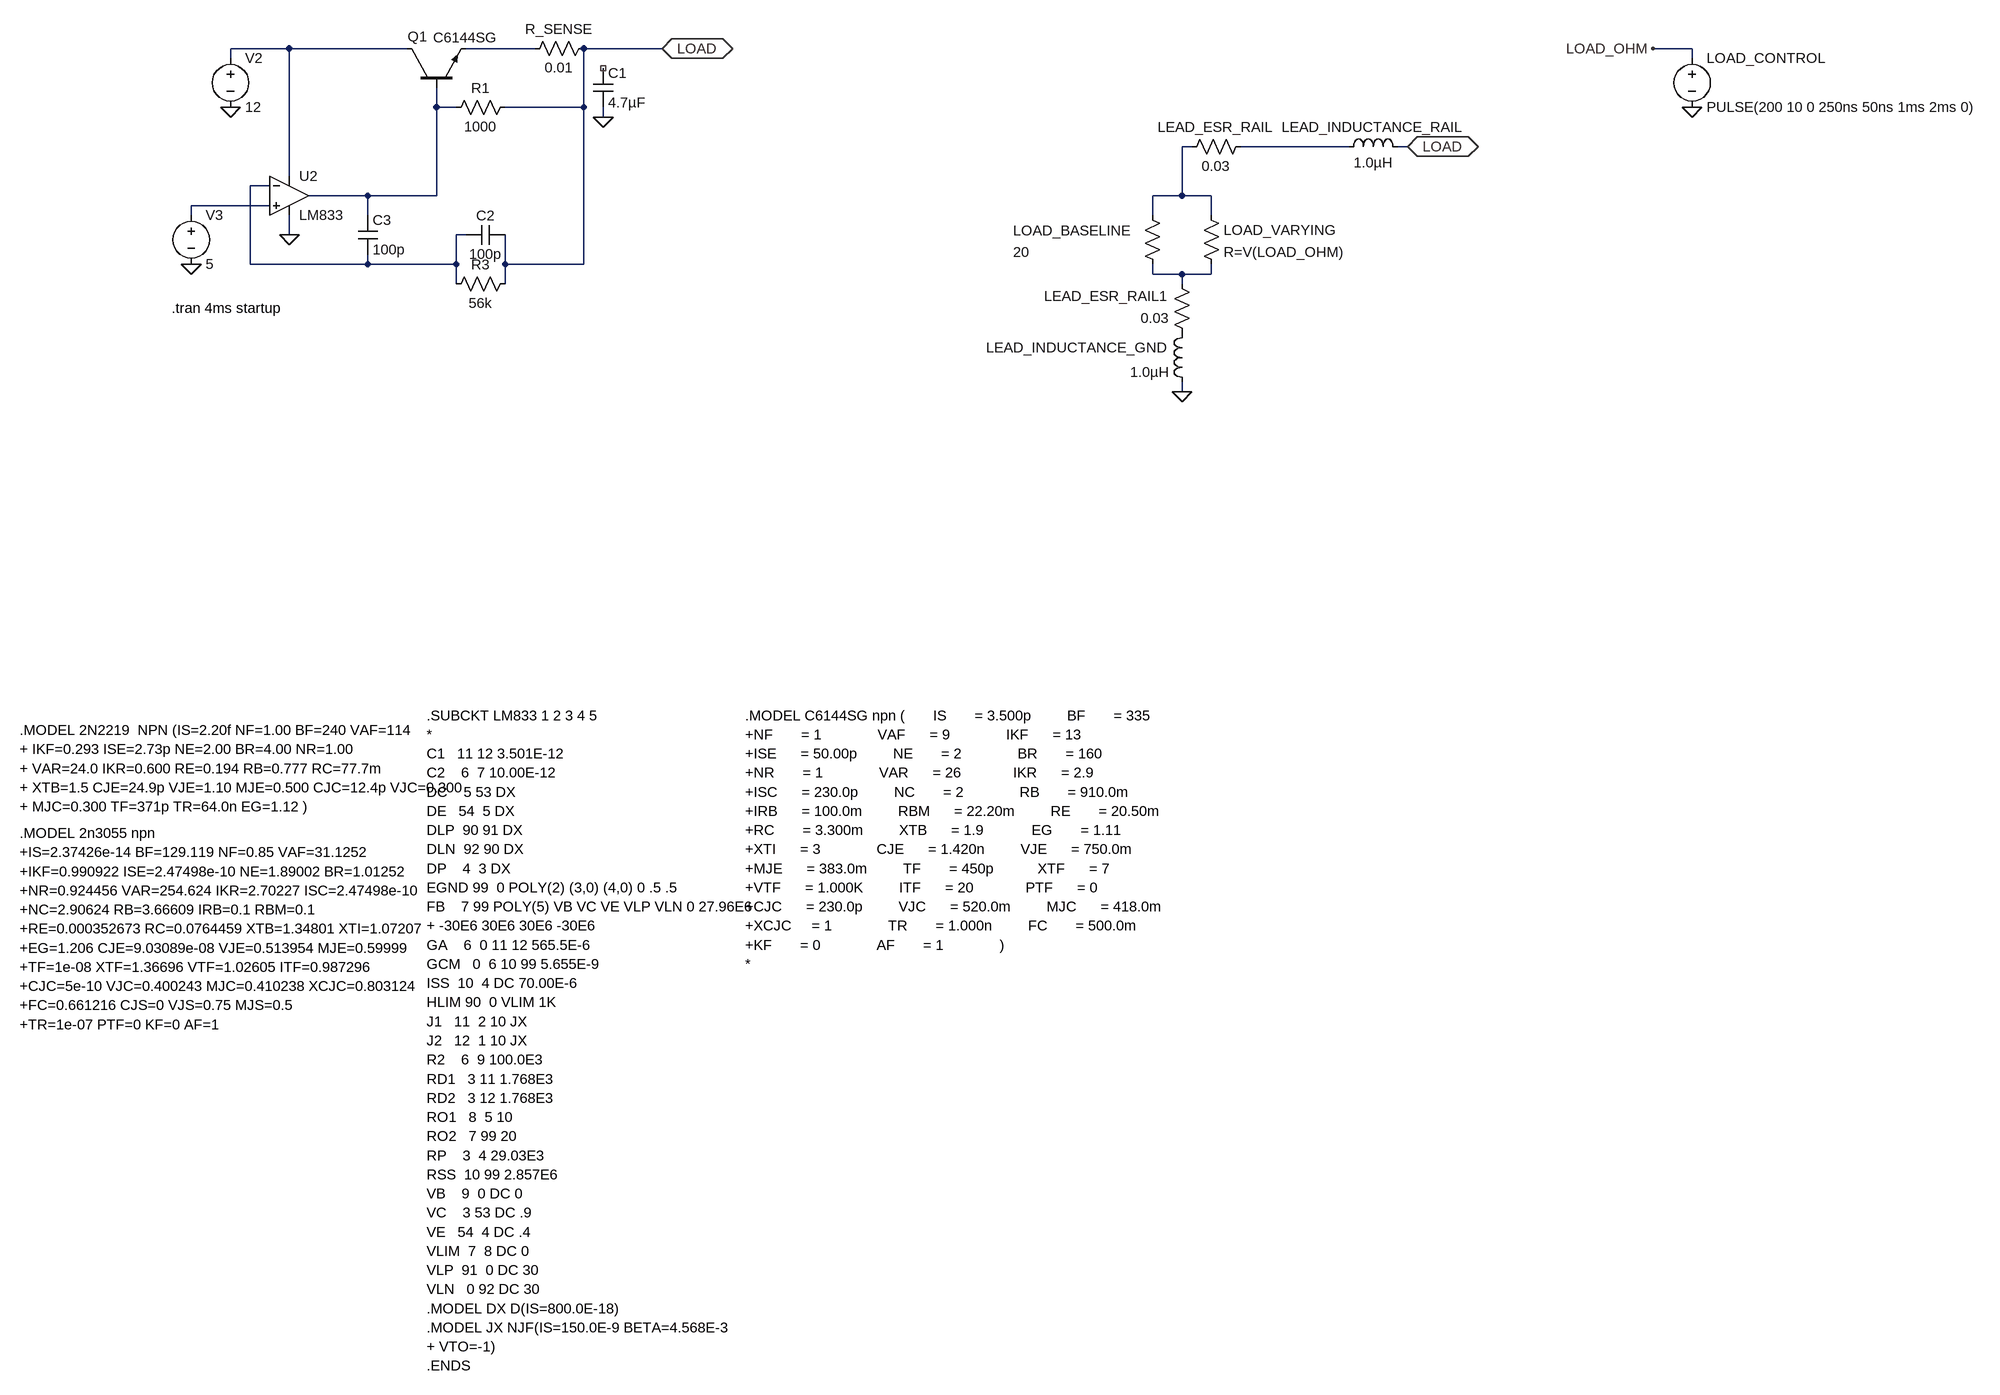
[diagram p0: schematic npn-pass-element-1.asc]
npn-pass-element-1.asc, the LTspice schematic file:
Version 4
SHEET 1 2764 2152
WIRE -128 96 -224 96
WIRE 64 96 -128 96
WIRE 272 96 160 96
WIRE 480 96 352 96
WIRE 2160 96 2096 96
WIRE -224 112 -224 96
WIRE 2160 112 2160 96
WIRE 112 192 112 160
WIRE 144 192 112 192
WIRE 352 192 352 96
WIRE 352 192 224 192
WIRE 384 208 384 192
WIRE 1344 256 1328 256
WIRE 1600 256 1424 256
WIRE 1696 256 1680 256
WIRE -128 304 -128 96
WIRE -160 320 -192 320
WIRE 0 336 -96 336
WIRE 112 336 112 192
WIRE 112 336 0 336
WIRE 1328 336 1328 256
WIRE 1328 336 1280 336
WIRE 1376 336 1328 336
WIRE -160 352 -288 352
WIRE -288 368 -288 352
WIRE 0 368 0 336
WIRE 1280 368 1280 336
WIRE 1376 368 1376 336
WIRE -128 400 -128 368
WIRE 160 400 144 400
WIRE -192 448 -192 320
WIRE 0 448 0 432
WIRE 0 448 -192 448
WIRE 144 448 144 400
WIRE 144 448 0 448
WIRE 224 448 224 400
WIRE 352 448 352 192
WIRE 352 448 224 448
WIRE 1280 464 1280 448
WIRE 1328 464 1280 464
WIRE 1376 464 1376 448
WIRE 1376 464 1328 464
WIRE 144 480 144 448
WIRE 224 480 224 448
WIRE 1328 480 1328 464
WIRE 1328 656 1328 640
FLAG -224 192 0
FLAG -128 400 0
FLAG -288 448 0
FLAG 2160 192 0
FLAG 2096 96 LOAD_OHM
FLAG 384 208 0
FLAG 480 96 LOAD
IOPIN 480 96 BiDir
FLAG 1696 256 LOAD
IOPIN 1696 256 BiDir
FLAG 1328 656 0
SYMBOL npn 64 160 R270
WINDOW 0 83 1 VRight 2
WINDOW 3 82 43 VRight 2
SYMATTR InstName Q1
SYMATTR Value C6144SG
SYMBOL voltage -224 96 R0
WINDOW 123 0 0 Left 2
WINDOW 39 0 0 Left 2
SYMATTR InstName V2
SYMATTR Value 12
SYMBOL voltage -288 352 R0
WINDOW 123 0 0 Left 2
WINDOW 39 0 0 Left 2
SYMATTR InstName V3
SYMATTR Value 5
SYMBOL res 240 176 R90
WINDOW 0 0 56 VBottom 2
WINDOW 3 32 56 VTop 2
SYMATTR InstName R1
SYMATTR Value 1000
SYMBOL voltage 2160 96 R0
WINDOW 123 0 0 Left 2
WINDOW 39 0 0 Left 2
SYMATTR InstName LOAD_CONTROL
SYMATTR Value PULSE(200 10 0 250ns 50ns 1ms 2ms 0)
SYMBOL res 1360 352 R0
SYMATTR InstName LOAD_VARYING
SYMATTR Value R=V(LOAD_OHM)
SYMBOL cap 368 128 R0
SYMATTR InstName C1
SYMATTR Value 4.7µF
SYMATTR SpiceLine Rser=0.1
SYMBOL res 240 464 R90
WINDOW 0 0 56 VBottom 2
WINDOW 3 32 56 VTop 2
SYMATTR InstName R3
SYMATTR Value 56k
SYMBOL cap 224 384 R90
WINDOW 0 0 32 VBottom 2
WINDOW 3 32 32 VTop 2
SYMATTR InstName C2
SYMATTR Value 100p
SYMBOL cap -16 368 R0
SYMATTR InstName C3
SYMATTR Value 100p
SYMBOL Opamps\\opamp2 -128 272 R0
SYMATTR InstName U2
SYMATTR Value LM833
SYMBOL res 1264 352 R0
WINDOW 0 -211 41 Left 2
WINDOW 3 -211 76 Left 2
SYMATTR InstName LOAD_BASELINE
SYMATTR Value 20
SYMBOL ind 1696 272 M270
WINDOW 0 32 56 VTop 2
WINDOW 3 5 56 VBottom 2
SYMATTR InstName LEAD_INDUCTANCE_RAIL
SYMATTR Value 1.0µH
SYMBOL res 256 112 R270
WINDOW 0 32 56 VTop 2
WINDOW 3 0 56 VBottom 2
SYMATTR InstName R_SENSE
SYMATTR Value 0.01
SYMBOL ind 1344 544 M0
SYMATTR InstName LEAD_INDUCTANCE_GND
SYMATTR Value 1.0µH
SYMBOL res 1440 240 R90
WINDOW 0 0 56 VBottom 2
WINDOW 3 32 56 VTop 2
SYMATTR InstName LEAD_ESR_RAIL
SYMATTR Value 0.03
SYMBOL res 1344 576 R180
WINDOW 0 36 76 Left 2
WINDOW 3 36 40 Left 2
SYMATTR InstName LEAD_ESR_RAIL1
SYMATTR Value 0.03
TEXT -320 520 Left 2 !.tran 4ms startup
TEXT -568 1208 Left 2 !.MODEL 2N2219  NPN (IS=2.20f NF=1.00 BF=240 VAF=114\n+ IKF=0.293 ISE=2.73p NE=2.00 BR=4.00 NR=1.00\n+ VAR=24.0 IKR=0.600 RE=0.194 RB=0.777 RC=77.7m\n+ XTB=1.5 CJE=24.9p VJE=1.10 MJE=0.500 CJC=12.4p VJC=0.300\n+ MJC=0.300 TF=371p TR=64.0n EG=1.12 )
TEXT -568 1376 Left 2 !.MODEL 2n3055 npn\n+IS=2.37426e-14 BF=129.119 NF=0.85 VAF=31.1252\n+IKF=0.990922 ISE=2.47498e-10 NE=1.89002 BR=1.01252\n+NR=0.924456 VAR=254.624 IKR=2.70227 ISC=2.47498e-10\n+NC=2.90624 RB=3.66609 IRB=0.1 RBM=0.1\n+RE=0.000352673 RC=0.0764459 XTB=1.34801 XTI=1.07207\n+EG=1.206 CJE=9.03089e-08 VJE=0.513954 MJE=0.59999\n+TF=1e-08 XTF=1.36696 VTF=1.02605 ITF=0.987296\n+CJC=5e-10 VJC=0.400243 MJC=0.410238 XCJC=0.803124\n+FC=0.661216 CJS=0 VJS=0.75 MJS=0.5\n+TR=1e-07 PTF=0 KF=0 AF=1
TEXT 96 1184 Left 2 !.SUBCKT LM833 1 2 3 4 5\n*\nC1   11 12 3.501E-12\nC2    6  7 10.00E-12\nDC    5 53 DX\nDE   54  5 DX\nDLP  90 91 DX\nDLN  92 90 DX\nDP    4  3 DX\nEGND 99  0 POLY(2) (3,0) (4,0) 0 .5 .5\nFB    7 99 POLY(5) VB VC VE VLP VLN 0 27.96E6\n+ -30E6 30E6 30E6 -30E6\nGA    6  0 11 12 565.5E-6\nGCM   0  6 10 99 5.655E-9\nISS  10  4 DC 70.00E-6\nHLIM 90  0 VLIM 1K\nJ1   11  2 10 JX\nJ2   12  1 10 JX\nR2    6  9 100.0E3\nRD1   3 11 1.768E3\nRD2   3 12 1.768E3\nRO1   8  5 10\nRO2   7 99 20\nRP    3  4 29.03E3\nRSS  10 99 2.857E6\nVB    9  0 DC 0\nVC    3 53 DC .9\nVE   54  4 DC .4\nVLIM  7  8 DC 0\nVLP  91  0 DC 30\nVLN   0 92 DC 30\n.MODEL DX D(IS=800.0E-18)\n.MODEL JX NJF(IS=150.0E-9 BETA=4.568E-3\n+ VTO=-1)\n.ENDS
TEXT 616 1184 Left 2 !.MODEL C6144SG npn (       IS       = 3.500p         BF       = 335           \n+NF       = 1              VAF      = 9              IKF      = 13            \n+ISE      = 50.00p         NE       = 2              BR       = 160           \n+NR       = 1              VAR      = 26             IKR      = 2.9           \n+ISC      = 230.0p         NC       = 2              RB       = 910.0m        \n+IRB      = 100.0m         RBM      = 22.20m         RE       = 20.50m        \n+RC       = 3.300m         XTB      = 1.9            EG       = 1.11          \n+XTI      = 3              CJE      = 1.420n         VJE      = 750.0m        \n+MJE      = 383.0m         TF       = 450p           XTF      = 7             \n+VTF      = 1.000K         ITF      = 20             PTF      = 0             \n+CJC      = 230.0p         VJC      = 520.0m         MJC      = 418.0m        \n+XCJC     = 1              TR       = 1.000n         FC       = 500.0m        \n+KF       = 0              AF       = 1              )                        \n*

The netlist it stands for:
* npn-pass-element-1.asc
Q1 N001 N003 N002 0 C6144SG
V2 N001 0 12
V3 N007 0 5
R1 LOAD N003 1000
V§LOAD_CONTROL LOAD_OHM 0 PULSE(200 10 0 250ns 50ns 1ms 2ms 0)
R§LOAD_VARYING N004 N008 R=V(LOAD_OHM)
C1 NC_01 0 4.7µF Rser=0.1
R3 LOAD N006 56k
C2 LOAD N006 100p
C3 N003 N006 100p
XU2 N007 N006 N001 0 N003 LM833  ; pins In+ In- V+ V- OUT
R§LOAD_BASELINE N004 N008 20
LEAD_INDUCTANCE_RAIL LOAD N005 1.0µH
R_SENSE N002 LOAD 0.01
LEAD_INDUCTANCE_GND P001 0 1.0µH
R§LEAD_ESR_RAIL N005 N004 0.03
R§LEAD_ESR_RAIL1 P001 N008 0.03
.model NPN NPN
.model PNP PNP
.lib standard.bjt
.tran 4ms startup
.MODEL 2N2219  NPN (IS=2.20f NF=1.00 BF=240 VAF=114
+ IKF=0.293 ISE=2.73p NE=2.00 BR=4.00 NR=1.00
+ VAR=24.0 IKR=0.600 RE=0.194 RB=0.777 RC=77.7m
+ XTB=1.5 CJE=24.9p VJE=1.10 MJE=0.500 CJC=12.4p VJC=0.300
+ MJC=0.300 TF=371p TR=64.0n EG=1.12 )
.MODEL 2n3055 npn
+IS=2.37426e-14 BF=129.119 NF=0.85 VAF=31.1252
+IKF=0.990922 ISE=2.47498e-10 NE=1.89002 BR=1.01252
+NR=0.924456 VAR=254.624 IKR=2.70227 ISC=2.47498e-10
+NC=2.90624 RB=3.66609 IRB=0.1 RBM=0.1
+RE=0.000352673 RC=0.0764459 XTB=1.34801 XTI=1.07207
+EG=1.206 CJE=9.03089e-08 VJE=0.513954 MJE=0.59999
+TF=1e-08 XTF=1.36696 VTF=1.02605 ITF=0.987296
+CJC=5e-10 VJC=0.400243 MJC=0.410238 XCJC=0.803124
+FC=0.661216 CJS=0 VJS=0.75 MJS=0.5
+TR=1e-07 PTF=0 KF=0 AF=1
.SUBCKT LM833 1 2 3 4 5
*
C1   11 12 3.501E-12
C2    6  7 10.00E-12
DC    5 53 DX
DE   54  5 DX
DLP  90 91 DX
DLN  92 90 DX
DP    4  3 DX
EGND 99  0 POLY(2) (3,0) (4,0) 0 .5 .5
FB    7 99 POLY(5) VB VC VE VLP VLN 0 27.96E6
+ -30E6 30E6 30E6 -30E6
GA    6  0 11 12 565.5E-6
GCM   0  6 10 99 5.655E-9
ISS  10  4 DC 70.00E-6
HLIM 90  0 VLIM 1K
J1   11  2 10 JX
J2   12  1 10 JX
R2    6  9 100.0E3
RD1   3 11 1.768E3
RD2   3 12 1.768E3
RO1   8  5 10
RO2   7 99 20
RP    3  4 29.03E3
RSS  10 99 2.857E6
VB    9  0 DC 0
VC    3 53 DC .9
VE   54  4 DC .4
VLIM  7  8 DC 0
VLP  91  0 DC 30
VLN   0 92 DC 30
.MODEL DX D(IS=800.0E-18)
.MODEL JX NJF(IS=150.0E-9 BETA=4.568E-3
+ VTO=-1)
.ENDS
.MODEL C6144SG npn (       IS       = 3.500p         BF       = 335
+NF       = 1              VAF      = 9              IKF      = 13
+ISE      = 50.00p         NE       = 2              BR       = 160
+NR       = 1              VAR      = 26             IKR      = 2.9
+ISC      = 230.0p         NC       = 2              RB       = 910.0m
+IRB      = 100.0m         RBM      = 22.20m         RE       = 20.50m
+RC       = 3.300m         XTB      = 1.9            EG       = 1.11
+XTI      = 3              CJE      = 1.420n         VJE      = 750.0m
+MJE      = 383.0m         TF       = 450p           XTF      = 7
+VTF      = 1.000K         ITF      = 20             PTF      = 0
+CJC      = 230.0p         VJC      = 520.0m         MJC      = 418.0m
+XCJC     = 1              TR       = 1.000n         FC       = 500.0m
+KF       = 0              AF       = 1              )
*
.backanno
.end